# Altium schematic sheet GPS.SchDoc: GPS
size A; Author: Craig Hesling; DrawnBy: Craig Hesling; Revision: 1
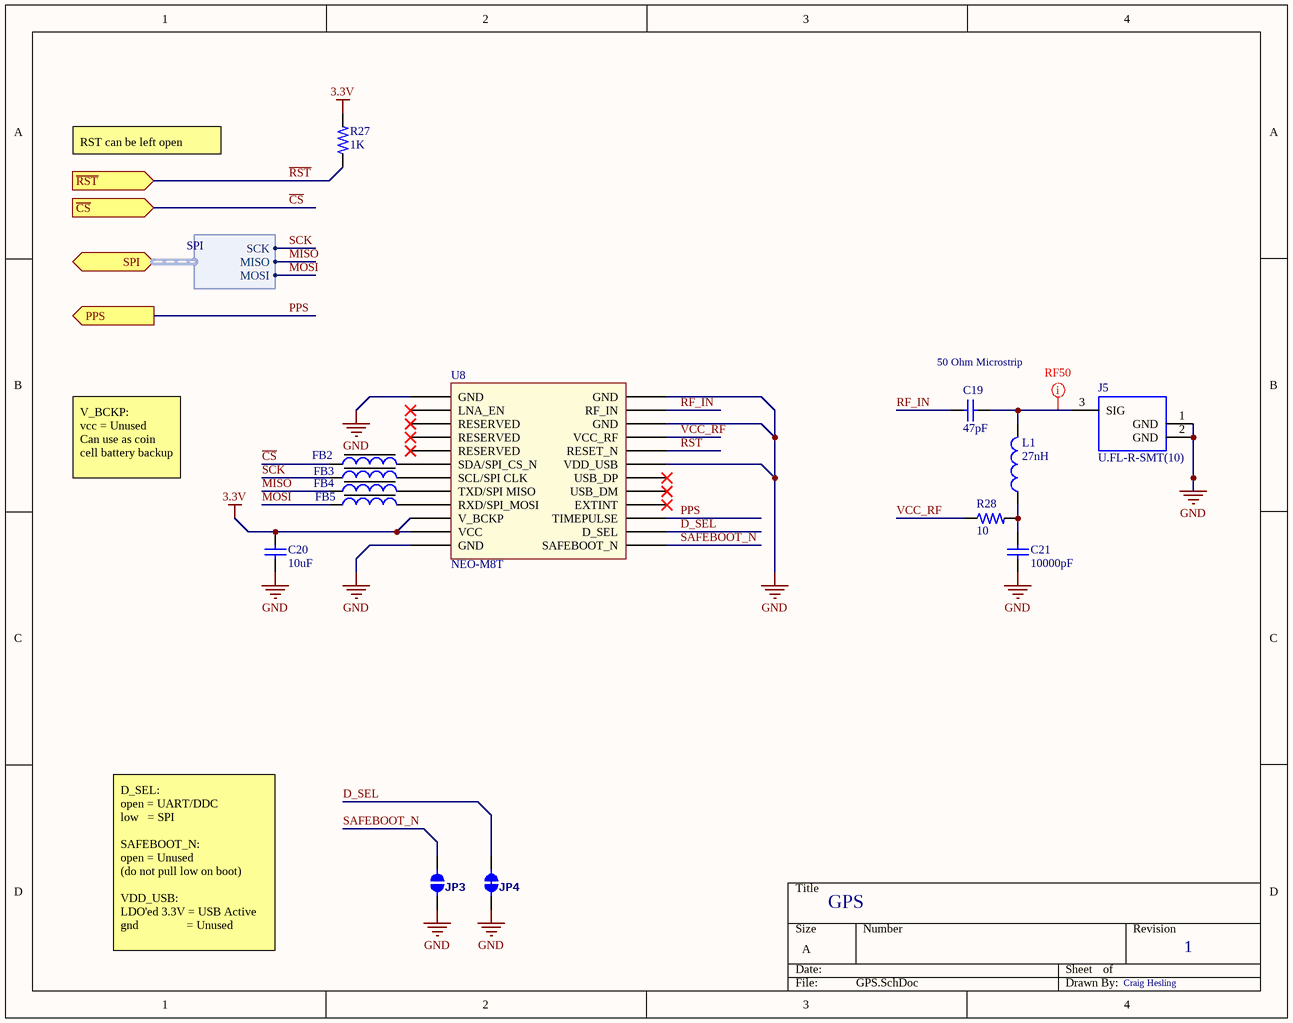
[diagram p0: GPS.SchDoc]

## Parts
C19  47pF  [CAPC1608X09L - CAP0603]
C20  10uF  [CAPC2013X14L - CAP0805 1.45mm Tall]
C21  10000pF  [CAPC1608X09L - CAP0603]
FB2  Feritte Bead 1kOhm  [FB1608X09L]  (value not drawn)
FB3  Feritte Bead 1kOhm  [FB1608X09L]  (value not drawn)
FB4  Feritte Bead 1kOhm  [FB1608X09L]  (value not drawn)
FB5  Feritte Bead 1kOhm  [FB1608X09L]  (value not drawn)
J5  U.FL-R-SMT(10)  [HRS-U.FL-R-SMT_V]
JP3  JUMPER-PAD-2-NO  [PAD-JUMPER-2-NO_NO_SILK]  (value not drawn)
JP4  JUMPER-PAD-2-NC_BY_TRACENO_SILK  [PAD-JUMPER-2-NC_BY_TRACE_NO_SILK]  (value not drawn)
L1  27nH  [INDC1608X09L - IND0603 0.95MM TALL]
R27  1K  [RESC1608X06L - RES0603]
R28  10  [RESC1608X06L - RES0603]
U8  NEO-M8T  [NEO]

## Ports
PPS (out), SPI (harness SPI), ~{CS} (in), ~{RST} (in)

## Harnesses
SPI: MISO, MOSI, SCK

## Nets
3.3V: C20.2 R27.2 U8.22(V_BCKP) U8.23(VCC)
GND: C20.1 C21.1 J5.1(GND) J5.2(GND) JP3.1 JP4.1 U8.7(VDD_USB) U8.10(GND) U8.12(GND) U8.13(GND) U8.24(GND)
~{CS}: FB2.1 ; port ~{CS}
D_SEL: JP4.2 U8.2(D_SEL)
MISO: FB4.1 ; port SPI.MISO
MOSI: FB5.1 ; port SPI.MOSI
PPS: U8.3(TIMEPULSE) ; port PPS
~{RST}: R27.1 U8.8(RESET_N) ; port ~{RST}
RF_IN: C19.1 U8.11(RF_IN)
SAFEBOOT_N: JP3.2 U8.1(SAFEBOOT_N)
SCK: FB3.1 ; port SPI.SCK
VCC_RF: R28.1 U8.9(VCC_RF)
NetC19_2: C19.2 J5.3(SIG) L1.2
NetC21_2: C21.2 L1.1 R28.2
NetFB2_2: FB2.2 U8.18(SDA/SPI_CS_N)
NetFB3_2: FB3.2 U8.19(SCL/SPI_CLK)
NetFB4_2: FB4.2 U8.20(TXD/SPI_MISO)
NetFB5_2: FB5.2 U8.21(RXD/SPI_MOSI)

Not connected (* = marked no-connect by the designer): U8 4(EXTINT)* 5(USB_DM)* 6(USB_DP)* 14(LNA_EN)* 15(RESERVED)* 16(RESERVED)* 17(RESERVED)*

## Layout directives
net class RF50: NetC19_2

## Notes on the sheet
- RST can be left open
- (near C19) 50 Ohm Microstrip
- V_BCKP:
  vcc = Unused
  Can use as coin cell battery backup
- D_SEL:
  open = UART/DDC
  low   = SPI
  SAFEBOOT_N:
  open = Unused
  (do not pull low on boot)
  VDD_USB:
  LDO'ed 3.3V = USB Active
  gnd                = Unused

## Library data of the parts
C19 = CAP0603 47pF 5% 50V NP0: SMT 0603 Ceramic Capacitor; TempCoeff: NP0; Tolerance: 5%; Voltage: 50V; Value: 47pF; Supplier 1: Digi-Key; Supplier 2: Digi-Key; Supplier 3: Arrow; Supplier 4: Digi-Key; Supplier Part Number 1: 1276-1037-1-ND; Supplier Part Number 2: 1276-2296-1-ND; Supplier Part Number 3: CFabNzdY6X6BB7Ej2OVMNUmEE8oTDHVGVspzp79aHa0; Supplier Part Number 4: 399-1056-1-ND
C20 = CAP0805 10uF 10% 6.3V X5R: SMT 0805 Ceramic Capacitor; TempCoeff: X5R; Tolerance: 10%; Voltage: 6.3V; Value: 10uF; Supplier 1: Digi-Key; Supplier Part Number 1: 1276-6457-1-ND
C21 = CAP0603 10000pF 10% 50V X7R: SMT 0603 Ceramic Capacitor; TempCoeff: X7R; Tolerance: 10%; Voltage: 50V; Value: 10000pF; Supplier 1: Digi-Key; Supplier 2: Digi-Key; Supplier 3: Digi-Key; Supplier Part Number 1: 478-1215-1-ND; Supplier Part Number 2: 311-1080-1-ND; Supplier Part Number 3: 490-1494-1-ND
FB2-FB5 = FB0603 1kOhm: Impedance at 100MHz: 1kOhms; Supplier 1: Digi-Key; Supplier Part Number 1: 490-1015-1-ND
J5 = CMP-0029-00003-1: Ultra Small Surface Mount Coaxial Connector, 50 Ohm, -40 to 90 degC, 3-Pin SMD, RoHS, Tape and Reel; Current Rating: 3 A; DatasheetVersion: Aug-16; Mount: Through Hole; Contact Material: Bronze; Length: 101.19 mm; Radiation Hardening: No; Height: 8.13 mm; ComponentLink1Description: Manufacturer URL; Pins: 80; Package Quantity: 50; ComponentLink2URL: https://www.hirose.com/product/en/download_file/key_name/U.FL/category/Catalog/doc_file_id/31697/?file_category_id=4&item_id=15&is_series=1; Lead Pitch: 2.54 mm; Max Operating Temperature: 105degC; Width: 4.88 mm; RoHSCompliant: True; Contact Plating: Tin; PackageReference: U.FL-R-SMT; Packaging: Bulk; Contact Finish: Lead; PackageDescription: 3-Pin Surface Mount Device, Body 2.6 x 2.6 mm; Min Operating Temperature: -65degC; ComponentLink1URL: https://www.hirose.com; ComponentLink2Description: Datasheet; Colour: Black
L1 = IND0603 27nH 400mA 5% 650mOhm 1.7GHz: SMT 0603 Ceramic Inductor; Tolerance: 5%; Current Rating: 300mA; DC Resistance: 450mOhm; Self Resonant: 1.7GHz; Value: 27nH; Supplier 1: Digi-Key; Supplier Part Number 1: 732-6268-1-ND
R27 = RES0603 1K 1% 1/10W: SMT 0603 Ceramic Resistor; Power: 1/10W; Tolerance: 1%; Value: 1K; Supplier 1: Digi-Key; Supplier 2: Digi-Key; Supplier 3: Digi-Key; Supplier Part Number 1: 311-1.00KHRCT-ND; Supplier Part Number 2: P1.00KHCT-ND; Supplier Part Number 3: RMCF0603FG1K00CT-ND
R28 = RES0603 10 1% 1/10W: SMT 0603 Ceramic Resistor; Power: 1/10W; Tolerance: 1%; Value: 10; Supplier 1: Digi-Key; Supplier 2: Digi-Key; Supplier 3: Digi-Key; Supplier Part Number 1: 311-10.0HRCT-ND; Supplier Part Number 2: RMCF0603FT10R0CT-ND; Supplier Part Number 3: CR0603-FX-10R0ELFCT-ND
U8 = NEO: u-blox NEO GNSS module; Part Description: u-blox GNSS module; Value: NEO-M8; Manufacturer: u-blox